# Altium schematic sheet 5V变压模块.SchDoc
size A4
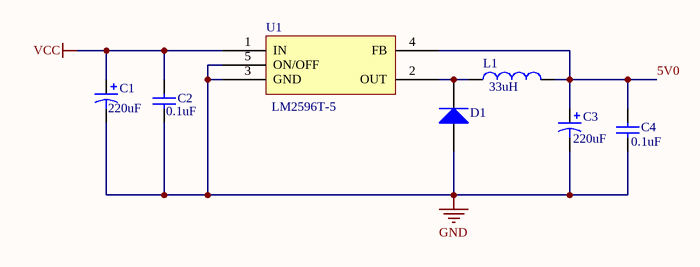
[diagram p0: 5V变压模块.SchDoc]

## Parts
C1  value 220uF  [C0805]  (hidden comment: Cap Pol3)
C2  value 0.1uF  [C1206]  (hidden comment: Cap Semi)
C3  value 220uF  [C0805]  (hidden comment: Cap Pol3)
C4  value 0.1uF  [C1206]  (hidden comment: Cap Semi)
D1  Diode BAT18  [SOT-23_N]  (value not drawn)
L1  value 33uH  [0402-A]  (hidden comment: Inductor)
U1  LM2596T-5

## Nets
GND: C1.2 C2.1 C3.2 C4.1 D1.1(A) U1.3(GND) U1.5(ON/OFF)
VCC: C1.1 C2.2 U1.1(IN)
5V0: C3.1 C4.2 L1.2 U1.4(FB)
NetD1_3: D1.3(K) L1.1 U1.2(OUT)

## Library data of the parts
C1 C3 = Cap Pol3: Polarized Capacitor (Surface Mount); Published: 8-Jun-2000; LatestRevisionDate: 29-May-2009; LatestRevisionNote: IPC-7351 Footprint Added.; PackageReference: C0805; Publisher: Altium Limited; PackageDescription: Chip Capacitor
C2 C4 = Cap Semi: Capacitor (Semiconductor SIM Model); Published: 8-Jun-2000; LatestRevisionDate: 29-May-2009; LatestRevisionNote: IPC-7351 Footprint Added.; PackageReference: C1206; Publisher: Altium Limited; PackageDescription: Chip Capacitor
D1 = Diode BAT18: Low-Loss RF Switching Diode; Note: Pin 2 is not connected and not drawn.; Published: 21-Mar-2003; LatestRevisionDate: 29-May-2009; LatestRevisionNote: IPC-7351 Footprint Added.; DatasheetVersion: Oct-1999; PackageVersion: Sep-2001; PackageReference: SOT-23; Publisher: Altium Limited; PackageDescription: 3-Pin SOT-23 Package 0.95 mm Pitch, 2.5 mm Lead Span; ComponentLink1Description: Manufacturer Link; ComponentLink1URL: http://www.infineon.com/
L1 = Inductor: Code_IEC: 1005; Published: 8-Jun-2000; LatestRevisionDate: 29-May-2009; LatestRevisionNote: IPC-7351 Footprint Added.; PackageReference: 0402-A; Publisher: Altium Limited; PackageDescription: Chip Inductor; Code_JEITA: 0402
U1 = LM2596T